# EAGLE design motordriverboard (EAGLE 9.3.0)
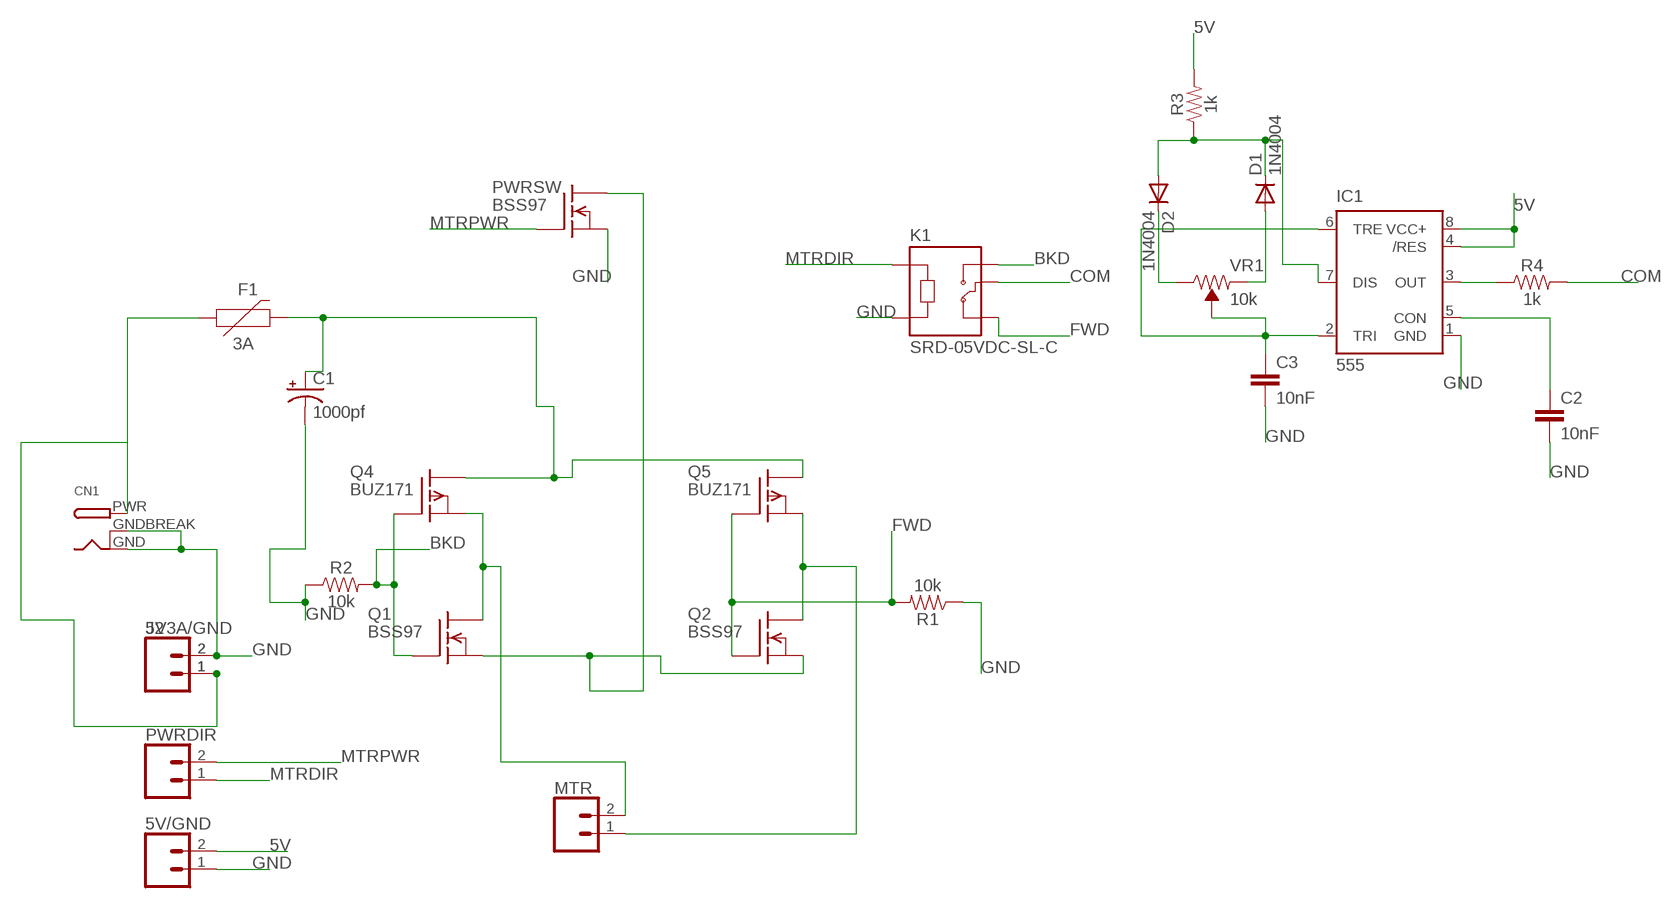
[diagram p0: schematic, sheet 1]

## Parts
5V3A/GND  CONN_023.5MM  [SCREWTERMINAL-3.5MM-2]
5V/GND  CONN_023.5MM  [SCREWTERMINAL-3.5MM-2]
C1  1000pf  CPOL-USE5-6  [E5-6]
C2  10nF  10NF-PTH-10MM-10000V-1-%  [CAP-PTH-10MM]
C3  10nF  10NF-PTH-10MM-10000V-1-%  [CAP-PTH-10MM]
CN1  DCBARRELPTH  [DCJACK_2MM_PTH]
D1  1N4004  [DO41-10]
D2  1N4004  [DO41-10]
F1  3A  PPTC_PTH  [PTH]
IC1  555  555P  [DIP08]
J2  CONN_023.5MM  [SCREWTERMINAL-3.5MM-2]
K1  SRD-05VDC-SL-C  [RELAY_SRD-05VDC-SL-C]
MTR  CONN_023.5MM  [SCREWTERMINAL-3.5MM-2]
PWRDIR  CONN_023.5MM  [SCREWTERMINAL-3.5MM-2]
PWRSW  BSS97  [TO202]
Q1  BSS97  [TO202]
Q2  BSS97  [TO202]
Q4  BUZ171  [TO220]
Q5  BUZ171  [TO220]
R1  10k  15KOHM-HORIZ-1/4W-5%  [AXIAL-0.3]
R2  10k  15KOHM-HORIZ-1/4W-5%  [AXIAL-0.3]
R3  1k  1KOHM-HORIZ-1/4W-1%  [AXIAL-0.3]
R4  1k  1KOHM-HORIZ-1/4W-1%  [AXIAL-0.3]
VR1  10k  TRIMPOT-PTH-10MM-KNOB-1/2W-10%  [TRIMPOT-PTH-3386U]

## Nets
5V: 5V/GND.2 IC1.4(/RES) IC1.8(VCC+) R3.P$2
BKD: K1.NO Q1.3(G) Q4.1(G) R2.P$2
COM: K1.COM R4.P$2
FWD: K1.NC Q2.3(G) Q5.1(G) R1.P$2
GND: 5V3A/GND.2 5V/GND.1 C1.- C2.2 C3.2 CN1.GND CN1.GNDBREAK IC1.1(GND) J2.2 K1.A2 PWRSW.1(S) R1.P$1 R2.P$1
MTRDIR: K1.A1 PWRDIR.1
MTRPWR: PWRDIR.2 PWRSW.3(G)
N$1: C2.1 IC1.5(CON)
N$3: IC1.3(OUT) R4.P$1
N$4: C3.1 IC1.2(TRI) IC1.6(TRE) VR1.2(WIPER)
N$5: C1.+ F1.P$2 Q4.2(D) Q5.2(D)
N$6: D1.C D2.A IC1.7(DIS) R3.P$1
N$7: MTR.1 Q2.2(D) Q5.3(S)
N$9: MTR.2 Q1.2(D) Q4.3(S)
N$10: PWRSW.2(D) Q1.1(S) Q2.1(S)
N$11: 5V3A/GND.1 CN1.PWR F1.P$1 J2.1
N$12: D2.C VR1.3(CW)
N$13: D1.A VR1.1(CCW)

## Library data of the parts
5V3A/GND 5V/GND J2 MTR PWRDIR = SparkFun-Connectors:CONN_02: Multi connection point. Often used as Generic Header-pin footprint for 0.1 inch spaced/style header connections On any of the 0.1 inch spaced packages, you can populate with these: Break Away Headers - Straight <https://www.sparkfun.com/products/116> (PRT-00116) Break Away Male Headers - Right Angle <https://www.sparkfun.com/products/553> (PRT-00553) Female Headers <https://www.sparkfun.com/products/115> (PRT-00115) Break Away Headers - Machine Pin <https://www.sparkfun.com/products/117> (PRT-00117) Break Away Female Headers - Swiss Machine Pin <https://www.sparkfun.com/products/743> (PRT-00743) For SCREWTERMINALS and SPRING TERMINALS visit here: Screw Terimnals on SparkFun.com <https://www.sparkfun.com/search/results?term=Screw+Terminals> (5mm/3.5mm/2.54mm spacing) This device is also useful as a general connection point to wire up your design to another part of your project. Our various solder wires solder well into these plated through hole pads. Hook-Up Wire - Assortment (Stranded, 22 AWG) <https://www.sparkfun.com/products/11375> (PRT-11375) Hook-Up Wire - Assortment (Solid Core, 22 AWG) <https://www.sparkfun.com/products/11367> (PRT-11367) View the entire wire category on our website here <https://www.sparkfun.com/categories/141> Special notes: Molex polarized connector foot print use with: PRT-08233 with associated crimp pins and housings. 2.54_SCREWTERM for use with PRT-10571. 3.5mm Screw Terminal footprints for PRT-08084 5mm Screw Terminal footprints for use with PRT-08432; PROD_ID: CONN-08399
C1 = adafruit:CPOL-US: POLARIZED CAPACITOR, American symbol
C2 C3 = SparkFun-Capacitors:10NF: 0.01uF/10nF/10,000pF ceramic capacitors A capacitor is a passive two-terminal electrical component used to store electrical energy temporarily in an electric field. CAP-09321; PROD_ID: CAP-09321
CN1 = adafruit:DCBARREL: 2.0mm DC Barrel Jack DCJACK_2MM_PTH - Through Hole Jack (4UConnector: 05537)
D1 D2 = adafruit:1N4004: DIODE General purpose 1N400x type rectifier (With bigger pads) http://www.ladyada.net/library/pcb/eaglelibrary.html
F1 = SparkFun-Fuses:PPTC: Resettable Fuse PPTC Resettable Fuse. Really a sort of resistor with a polymeric positive temperature coefficient whose resistance increases dramatically with an increase in temperature. When heated by the power passing through the resistance rises causing the current to be limited, protecting the circuit. This is achieved by the transition of the polymer from a crystalline to an amorphous state where the conductive carbon separates breaking the conductive pathways found in the cool crystalline structure. When a PPTC cools back down it resumes conducting letting the circuit turn back on. SparkFun Products: SparkFun RedBoard - Programmed with Arduino <https://www.sparkfun.com/products/12757> Pro Micro - 5V/16MHz <https://www.sparkfun.com/products/12640> Arduino Pro 328 - 5V/16MHz <https://www.sparkfun.com/products/10915> MP3 Trigger <https://www.sparkfun.com/products/13720>; PROD_ID: RES-08490; VALUE: 72V/0.25A
IC1 = SparkFun-IC-Special-Function:555: General purpose bipolar Timer Datasheet <http://www.sparkfun.com/datasheets/Components/General/ne555.pdf> SparkFun Products SparkFun SparkPunk Sequencer Kit <https://www.sparkfun.com/products/12707> (KIT-12707) Storefront Component: 555 Timer <https://www.sparkfun.com/products/9273> (COM-09273) Two parts valid for production: VFP: IC-11930 (M7555 PTH) VFP: IC-09173 (555 PTH) - Preferred; PROD_ID: IC-09173; PROD_ID_ALT: IC-09173
K1 = SRD-05VDC-SL-C:SRD-05VDC-SL-C: 5V Trigger Relay Module For Arduino And Raspberry Pi 5V Trigger Relay Module For Arduino And Raspberry Pi; AVAILABILITY: Unavailable; DESCRIPTION: 5V Trigger Relay Module For Arduino And Raspberry Pi 5V Trigger Relay Module For Arduino And Raspberry Pi; MF: Songle Relay; MP: SRD-05VDC-SL-C; PACKAGE: None; PRICE: None
PWRSW Q1 Q2 = transistor-fet:BSS97: N-Channel Enhancement MOSFET 200V; 1.5A; 1,6Ohm
Q4 Q5 = transistor-fet:BUZ171: P-Channel Enhancement MOSFET -50V; 7A; 0,4Ohm
R1 R2 = SparkFun-Resistors:15KOHM: 15kΩ resistor A resistor is a passive two-terminal electrical component that implements electrical resistance as a circuit element. Resistors act to reduce current flow, and, at the same time, act to lower voltage levels within circuits. - Wikipedia; PROD_ID: RES-11360; VALUE: 15k
R3 R4 = SparkFun-Resistors:1KOHM: 1kΩ resistor A resistor is a passive two-terminal electrical component that implements electrical resistance as a circuit element. Resistors act to reduce current flow, and, at the same time, act to lower voltage levels within circuits. - Wikipedia; PROD_ID: RES-12182
VR1 = SparkFun-Resistors:TRIMPOT: Trimming Potentiometer (Trimpot) Three-terminal potentiometers, with an adjustable wiper and two adjustable resistors. A pot can be used to create a configurable voltage divider, or as a variable resistor. "Trimpots" are a subset of potentiometers, usually intended for "set-and-forget" applications. They're often more delicate than standard potentiometers - rated for fewer turns. Variants PTH-KNOB - PTH Trimpot w/ finger-adjustable knob Trimpot 10K with Knob <https://www.sparkfun.com/products/9806> (COM-09806) Datasheet <http://www.sparkfun.com/datasheets/Components/General/TSR-3386.pdf> SMD-3MM-CLOSED-FRAME - SMD 3mm Square Closed-Frame Trimpot Used on e.g. EasyDriver - Stepper Motor Driver <https://www.sparkfun.com/products/12779> Datasheet <http://www.bitechnologies.com/pdfs/22.pdf> (22AR10KTR) SMD-5MM - SMD 5mm Square Closed-Frame Trimpot Used on e.g. IOIO-OTG - V2.2 <https://www.sparkfun.com/products/13613> Datasheet <http://www.vishay.com/docs/51008/ts53.pdf> (TS53YL502MR10) SMD-3MM-1/10W-25% - 3mm Square Open-Frame Trimpot Used on e.g. SparkFun Shapeoko <https://www.sparkfun.com/products/13899> Datasheet <http://www.bourns.com/docs/Product-Datasheets/TC33.pdf> (TC33X-2-103E); PROD_ID: RES-09730; SF_SKU: COM-09806

## Board
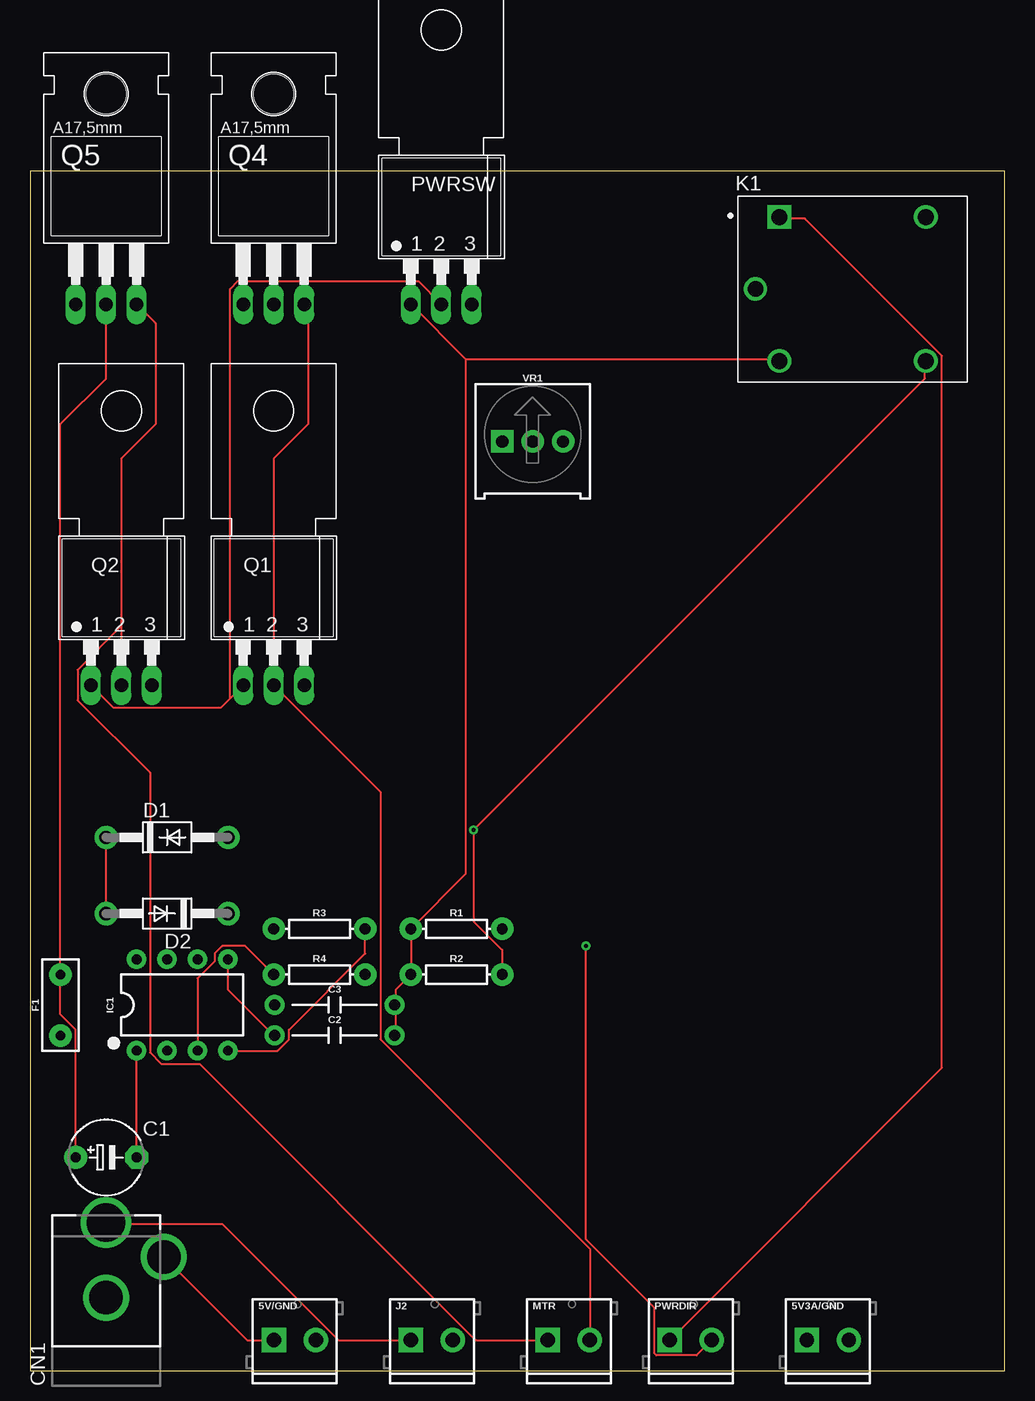
[diagram p1: board, top side]
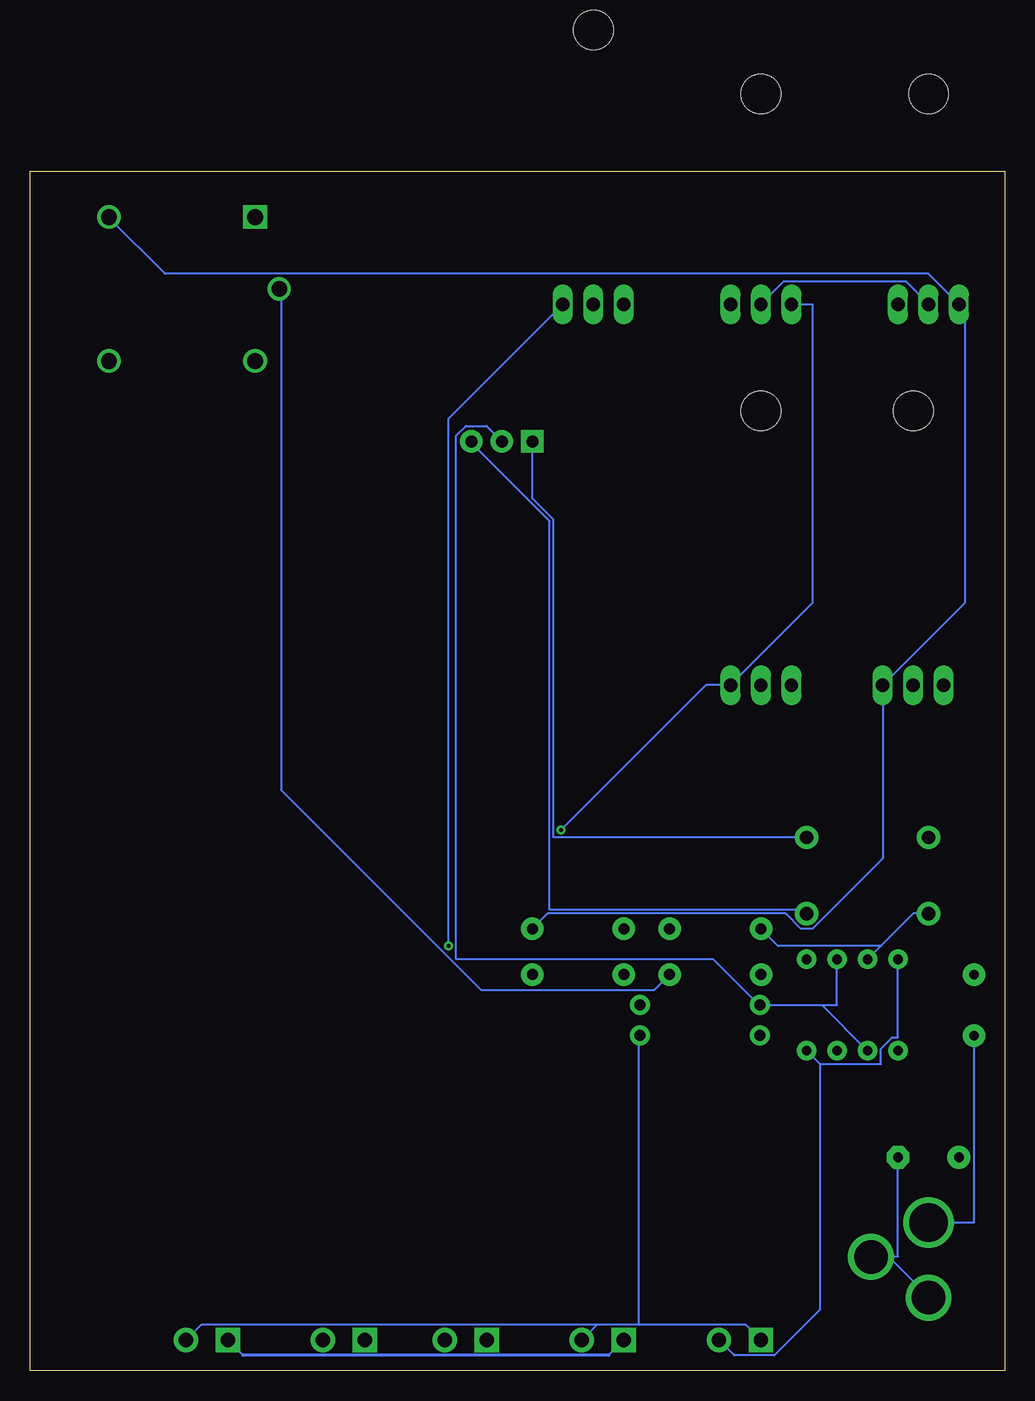
[diagram p2: board, bottom side, seen from below]

Size 81.26 x 100 mm. Coordinates in mm from the lower left corner, seen from the top.
Outline: 0,0 81.26,0 81.26,100 0,100 0,0
Copper layers (1*16): Top 0.035mm / dielectric 1.5mm / Bottom 0.035mm
Design rules "default": minimum track width 6mil, minimum drill 0.35mm, track to track 6mil, track to pad 6mil, pad to pad 6mil, via to via 6mil, smd to smd 6mil, copper to edge 40mil, drill to drill 6mil, minimum pad ring 10mil, minimum via ring 8mil, stop-mask expansion 4mil, vias tented up to drill 0mil, thermal gap 10mil

### Footprints (pad centres in the part's own frame; a part is rotated, then mirrored left to right if it is on the bottom)
SCREWTERMINAL-3.5MM-2 = drill 1.2 pad 2.032 square: 1 0,0 | drill 1.2 pad 2.032: 2 3.5,0
E5-6 = drill 0.813 pad 1.905: + -2.54,0 | drill 0.813 pad 1.905 octagon: - 2.54,0
CAP-PTH-10MM = drill 0.9 pad 1.651: 1 -5,0; 2 5,0
DCJACK_2MM_PTH = drill 2.8: GND 0,7.35; GNDBREAK 4.8,10.75 | drill 3.2: PWR 0,13.6
DO41-10 = drill 1.118 pad 1.93: A 5.08,0; C -5.08,0
PTH = drill 0.8 pad 1.88: P$1 -2.54,0; P$2 2.54,0
DIP08 = drill 0.813 pad 1.626: 1 -3.81,-3.81; 2 -1.27,-3.81; 3 1.27,-3.81; 4 3.81,-3.81; 5 3.81,3.81; 6 1.27,3.81; 7 -1.27,3.81; 8 -3.81,3.81
RELAY_SRD-05VDC-SL-C = drill 1.32 square: A1 -6.1,6 | drill 1.32: A2 -6.1,-6; NC 6.1,6; NO 6.1,-6 | drill 1.29: COM -8.1,0
TO202 = drill 1.118 long: 1 -2.54,-5.08; 2 0,-5.08; 3 2.54,-5.08 | hole 3.302: 0,17.78
TO220 = drill 1.118 long: 1 -2.54,-6.35; 2 0,-6.35; 3 2.54,-6.35 | hole 3.302: 0,11.176
AXIAL-0.3 = drill 0.9 pad 1.88: P$1 -3.81,0; P$2 3.81,0
TRIMPOT-PTH-3386U = drill 1.016 pad 1.88 square: 1 -2.54,-0.015 | drill 1.016 pad 1.88: 2 0,-0.015; 3 2.54,-0.015

### Placement (x,y rotation side)
5V3A/GND  64.77,2.54 0 top
5V/GND  20.32,2.54 0 top
C1  6.35,17.78 0 top
C2  25.4,27.94 0 top
C3  25.4,30.48 0 top
CN1  6.35,-1.27 0 top
D1  11.43,44.45 0 top
D2  11.43,38.1 180 top
F1  2.54,30.48 90 top
IC1  12.7,30.48 0 top
J2  31.75,2.54 0 top
K1  68.58,90.17 0 top
MTR  43.18,2.54 0 top
PWRDIR  53.34,2.54 0 top
PWRSW  34.29,93.98 0 top
Q1  20.32,62.23 0 top
Q2  7.62,62.23 0 top
Q4  20.32,95.25 0 top
Q5  6.35,95.25 0 top
R1  35.56,36.83 0 top
R2  35.56,33.02 0 top
R3  24.13,36.83 0 top
R4  24.13,33.02 0 top
VR1  41.91,77.47 0 top

### Tracks (layer width: path | path; a pad name or v marks a point on that pad's centre or on a via)
5V
  Top 0.152: R3.P$2 27.94,34.77 21.59,28.42 21.59,27.62 20.64,26.67 IC1.4
  Bottom 0.152: IC1.8 8.89,27.78 9.37,27.78 10.32,26.83 10.32,25.56 15.4,25.56 | IC1.4 15.4,25.56 | 15.4,25.56 15.4,5.08 19.21,1.27 22.54,1.27 5V/GND.2
BKD  (via drill 0.35)
  Top 0.152: R2.P$2 39.37,35.08 36.99,37.47 v36.99,45.09 74.61,82.71 74.61,84.14 K1.NO
  Bottom 0.152: Q4.1 16.03,88.9 16.03,63.98 Q1.3 24.92,57.15 v36.99,45.09
COM
  Bottom 0.152: R4.P$2 29.21,31.75 43.66,31.75 60.33,48.42 60.33,90.17 K1.COM
FWD
  Bottom 0.152: R1.P$2 38.1,38.1 18.26,38.1 16.99,36.83 16.03,36.83 10.16,42.7 Q2.3 3.33,63.98 3.33,88.9 Q5.1 6.35,91.44 70.01,91.44 74.61,96.04 K1.NC
GND
  Top 0.152: 36.35,84.3 PWRSW.1 | 36.35,84.3 62.39,84.3 K1.A2 | 30.48,30.48 30.48,27.94 C2.2 | 30.48,30.48 30.48,31.75 R2.P$1 R1.P$1 36.35,41.43 36.35,84.3 | 30.48,30.48 C3.2 | C1.- IC1.1 | 5V/GND.1 18.1,2.54 11.27,9.37 CN1.GNDBREAK
  Bottom 0.152: 33.97,3.81 J2.2 | 30.48,3.81 21.59,3.81 5V/GND.1 | 30.48,3.81 33.97,3.81 | 33.97,3.81 66.99,3.81 5V3A/GND.2 | C1.- 8.89,9.53 9.68,9.53 | 9.68,9.53 11.11,9.53 CN1.GNDBREAK 9.68,9.53 | 30.48,3.81 30.48,27.94 C2.2 | 9.68,9.53 6.35,6.19 CN1.GND
MTRDIR
  Top 0.152: PWRDIR.1 76.04,25.24 76.04,84.61 64.61,96.04 62.55,96.04 K1.A1
MTRPWR  (via drill 0.35)
  Top 0.152: v46.35,35.4 46.35,10.95 52.07,5.24 52.07,1.43 52.23,1.27 55.56,1.27 PWRDIR.2
  Bottom 0.152: PWRSW.3 46.35,79.38 v46.35,35.4
N$1
  Top 0.152: IC1.5 16.51,31.75 20.32,27.94 C2.1
N$3
  Top 0.152: IC1.3 13.97,32.7 15.4,34.13 15.4,34.77 16.03,35.4 17.94,35.4 R4.P$1
N$4
  Bottom 0.152: 15.24,30.48 IC1.2 | 15.24,30.48 C3.1 20.48,30.48 24.29,34.29 45.72,34.29 45.72,77.95 44.93,78.74 43.18,78.74 41.91,77.47 VR1.2 | IC1.6 13.97,30.48 15.24,30.48
N$5
  Top 0.152: C1.+ 3.81,28.42 2.54,29.69 F1.P$2 2.54,78.9 6.35,82.71 Q5.2
  Bottom 0.152: Q5.2 8.26,90.81 18.41,90.81 Q4.2
N$6
  Top 0.152: D2.A D1.C
  Bottom 0.152: 10.32,35.4 7.62,38.1 D2.A | 10.32,35.4 IC1.7 | R3.P$1 18.89,35.4 10.32,35.4
N$7
  Top 0.152: 7.62,62.07 7.62,76.04 10.48,78.9 10.48,87.31 Q5.3 | 7.62,62.07 Q2.2 | MTR.1 37.15,2.54 14.13,25.56 10.95,25.56 10,26.51 10,49.85 3.97,55.88 3.97,58.42 7.62,62.07
N$9
  Top 0.152: Q4.3 23.18,88.58 23.18,78.9 20.32,76.04 Q1.2 29.21,48.26 29.21,27.62 46.67,10.16 MTR.2
N$10
  Top 0.152: Q2.1 6.99,55.24 15.88,55.24 16.67,56.04 | Q1.1 16.67,56.04 | PWRSW.2 32.38,90.81 17.3,90.81 16.67,90.17 16.67,56.04
N$11
  Top 0.152: J2.1 25.72,2.54 16.03,12.22 6.35,12.22 CN1.PWR
  Bottom 0.152: F1.P$1 2.54,12.38 6.35,12.38 CN1.PWR | 63.5,1.27 5V3A/GND.1 | J2.1 33.02,1.27
  Bottom 0.254: 33.02,1.27 63.5,1.27
N$12
  Bottom 0.152: D2.C 16.83,38.42 37.94,38.42 37.94,70.8 44.45,77.31 VR1.3
N$13
  Bottom 0.152: VR1.1 39.37,72.71 37.62,70.96 37.62,44.45 D1.A